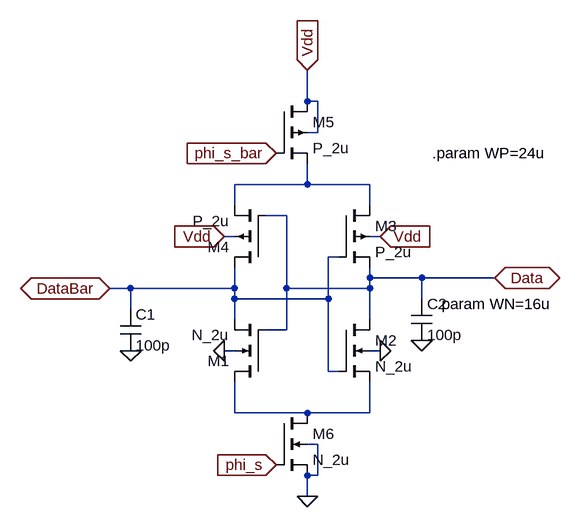
[diagram p0: schematic amp.asc]
amp.asc, the LTspice schematic file:
Version 4
SHEET 1 880 680
WIRE 176 -144 176 -192
WIRE 192 -144 176 -144
WIRE 192 -96 192 -144
WIRE 192 -96 176 -96
WIRE 176 -16 176 -48
WIRE 176 -16 64 -16
WIRE 272 -16 176 -16
WIRE 64 16 64 -16
WIRE 272 16 272 -16
WIRE 144 32 112 32
WIRE 64 64 48 64
WIRE 288 64 272 64
WIRE 224 96 208 96
WIRE 272 128 272 112
WIRE 352 128 272 128
WIRE 464 128 352 128
WIRE -96 144 -128 144
WIRE 64 144 64 112
WIRE 64 144 -96 144
WIRE 144 144 144 32
WIRE 272 144 272 128
WIRE 272 144 144 144
WIRE 64 160 64 144
WIRE 208 160 208 96
WIRE 208 160 64 160
WIRE 352 160 352 128
WIRE -96 176 -96 144
WIRE 64 192 64 160
WIRE 272 192 272 144
WIRE 144 208 144 144
WIRE 144 208 112 208
WIRE 64 240 48 240
WIRE 288 240 272 240
WIRE 208 272 208 160
WIRE 224 272 208 272
WIRE 64 336 64 288
WIRE 176 336 64 336
WIRE 272 336 272 288
WIRE 272 336 176 336
WIRE 192 384 176 384
WIRE 192 432 192 384
WIRE 192 432 176 432
WIRE 176 464 176 432
FLAG 176 -192 Vdd
IOPIN 176 -192 In
FLAG 128 -64 phi_s_bar
IOPIN 128 -64 In
FLAG 128 416 phi_s
IOPIN 128 416 In
FLAG 176 464 0
FLAG -128 144 DataBar
IOPIN -128 144 BiDir
FLAG 464 128 Data
IOPIN 464 128 BiDir
FLAG 288 64 Vdd
IOPIN 288 64 In
FLAG 48 64 Vdd
IOPIN 48 64 In
FLAG 288 240 0
FLAG 48 240 0
FLAG -96 240 0
FLAG 352 224 0
SYMBOL nmos4 112 288 R180
SYMATTR InstName M1
SYMATTR Value N_2u
SYMATTR Value2 l=2u w={WN}
SYMBOL nmos4 224 192 R0
SYMATTR InstName M2
SYMATTR Value N_2u
SYMATTR Value2 l=2u w={WN}
SYMBOL pmos4 224 16 R0
SYMATTR InstName M3
SYMATTR Value P_2u
SYMATTR Value2 l=2u w={WP}
SYMBOL pmos4 112 112 R180
SYMATTR InstName M4
SYMATTR Value P_2u
SYMATTR Value2 l=2u w={WP}
SYMBOL pmos4 128 -144 R0
SYMATTR InstName M5
SYMATTR Value P_2u
SYMATTR Value2 l=2u w={WP}
SYMBOL nmos4 128 336 R0
SYMATTR InstName M6
SYMATTR Value N_2u
SYMATTR Value2 l=2u w={WN}
SYMBOL cap -112 176 R0
SYMATTR InstName C1
SYMATTR Value 100p
SYMBOL cap 336 160 R0
SYMATTR InstName C2
SYMATTR Value 100p
TEXT 368 -64 Left 2 !.param WP=24u
TEXT 376 168 Left 2 !.param WN=16u

The netlist it stands for:
* amp.asc
M1 N002 Data DataBar 0 N_2u l=2u w={WN}
M2 Data DataBar N002 0 N_2u l=2u w={WN}
M3 N001 DataBar Data Vdd P_2u l=2u w={WP}
M4 DataBar Data N001 Vdd P_2u l=2u w={WP}
M5 Vdd phi_s_bar N001 Vdd P_2u l=2u w={WP}
M6 N002 phi_s 0 0 N_2u l=2u w={WN}
C1 DataBar 0 100p
C2 Data 0 100p
.model NMOS NMOS
.model PMOS PMOS
.lib standard.mos
.param WP=24u
.param WN=16u
.backanno
.end